# EAGLE design final (EAGLE 8.6.0)
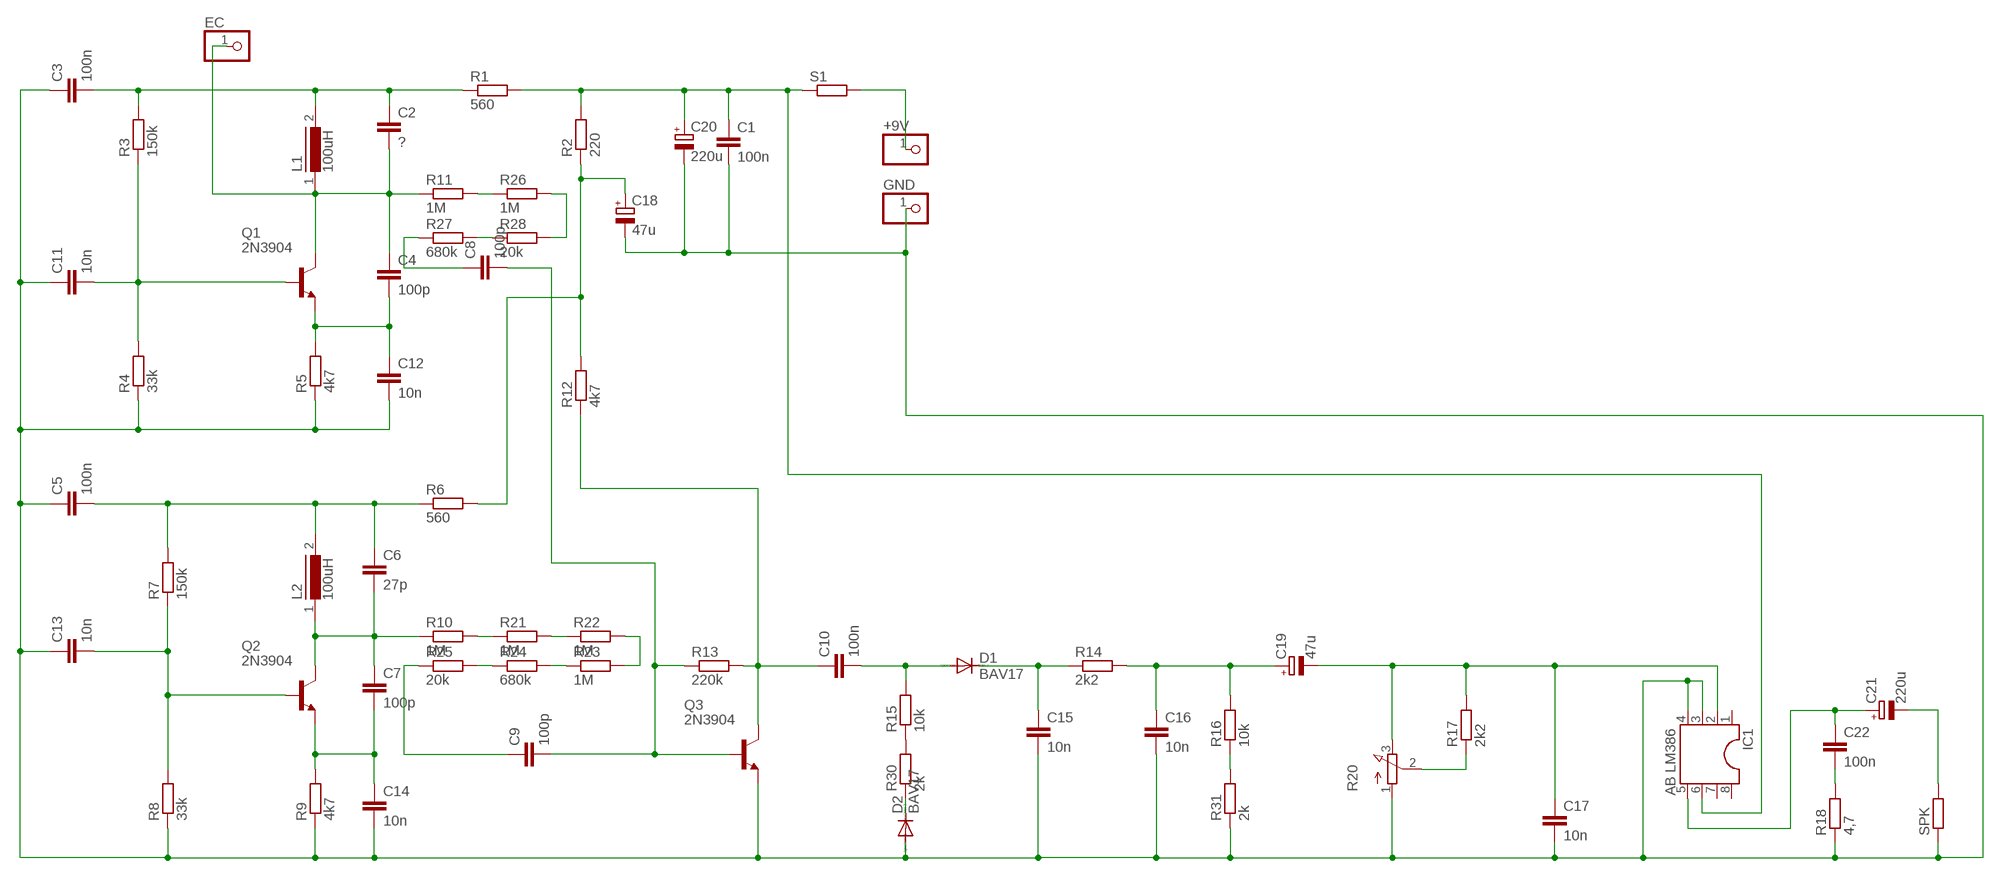
[diagram p0: schematic, sheet 1]

## Parts
+9V  PINHD-1X1  [1X01]
C1  100n  C-EU025-025X050  [C025-025X050]
C2  ?  C-EU025-025X050  [C025-025X050]
C3  100n  C-EU025-025X050  [C025-025X050]
C4  100p  C-EU025-025X050  [C025-025X050]
C5  100n  C-EU025-025X050  [C025-025X050]
C6  27p  C-EU025-025X050  [C025-025X050]
C7  100p  C-EU025-025X050  [C025-025X050]
C8  100p  C-EU025-025X050  [C025-025X050]
C9  100p  C-EU025-025X050  [C025-025X050]
C10  100n  C-EU025-025X050  [C025-025X050]
C11  10n  C-EU050-025X075  [C050-025X075]
C12  10n  C-EU050-025X075  [C050-025X075]
C13  10n  C-EU050-025X075  [C050-025X075]
C14  10n  C-EU050-025X075  [C050-025X075]
C15  10n  C-EU050-025X075  [C050-025X075]
C16  10n  C-EU050-025X075  [C050-025X075]
C17  10n  C-EU050-025X075  [C050-025X075]
C18  47u  CPOL-EUE5-6  [E5-6]
C19  47u  CPOL-EUE5-6  [E5-6]
C20  220u  CPOL-EUE5-8.5  [E5-8,5]
C21  220u  CPOL-EUE5-8.5  [E5-8,5]
C22  100n  C-EU025-025X050  [C025-025X050]
D1  BAV17  [DO35-10]
D2  BAV17  [DO35-10]
EC  PINHD-1X1  [1X01]
GND  PINHD-1X1  [1X01]
IC1  AB LM386  DIL8  [DIL08]
L1  100uH  82114R  [82114R]
L2  100uH  82114R  [82114R]
Q1  2N3904  [TO92]
Q2  2N3904  [TO92]
Q3  2N3904  [TO92]
R1  560  R-EU_0204/5  [0204/5]
R2  220  R-EU_0204/5  [0204/5]
R3  150k  R-EU_0204/5  [0204/5]
R4  33k  R-EU_0204/5  [0204/5]
R5  4k7  R-EU_0204/5  [0204/5]
R6  560  R-EU_0204/5  [0204/5]
R7  150k  R-EU_0204/5  [0204/5]
R8  33k  R-EU_0204/5  [0204/5]
R9  4k7  R-EU_0204/5  [0204/5]
R10  1M  R-EU_0204/5  [0204/5]
R11  1M  R-EU_0204/5  [0204/5]
R12  4k7  R-EU_0204/5  [0204/5]
R13  220k  R-EU_0204/5  [0204/5]
R14  2k2  R-EU_0204/5  [0204/5]
R15  10k  R-EU_0204/5  [0204/5]
R16  10k  R-EU_0204/5  [0204/5]
R17  2k2  R-EU_0204/5  [0204/5]
R18  4,7  R-EU_0204/5  [0204/5]
R20  3RP/1610N  [3RP/1610N]
R21  1M  R-EU_0204/5  [0204/5]
R22  1M  R-EU_0204/5  [0204/5]
R23  1M  R-EU_0204/5  [0204/5]
R24  680k  R-EU_0204/5  [0204/5]
R25  20k  R-EU_0204/5  [0204/5]
R26  1M  R-EU_0204/5  [0204/5]
R27  680k  R-EU_0204/5  [0204/5]
R28  20k  R-EU_0204/5  [0204/5]
R30  2k  R-EU_0204/5  [0204/5]
R31  2k  R-EU_0204/5  [0204/5]
S1  R-EU_0204/5  [0204/5]
SPK  R-EU_0204/5  [0204/5]

## Nets
N$1: C1.1 C20.+ IC1.6 R1.2 R2.2 S1.1
N$2: C21.+ C22.1 IC1.5
N$3: C13.2 Q2.2(B) R7.1 R8.2
N$4: C2.1 C3.2 L1.2 R1.1 R3.2
N$5: C2.2 C4.1 EC.1 L1.1 Q1.1(C) R11.1
N$6: C17.1 C19.- IC1.2 R17.2 R20.3(E)
N$7: C11.2 Q1.2(B) R3.1 R4.2
N$8: C4.2 C12.1 Q1.3(E) R5.2
N$9: R15.1 R30.2
N$10: R17.1 R20.2(S)
N$11: C5.2 C6.1 L2.2 R6.1 R7.2
N$12: C7.2 C14.1 Q2.3(E) R9.2
N$13: C6.2 C7.1 L2.1 Q2.1(C) R10.1
N$14: R10.2 R21.1
N$15: R21.2 R22.1
N$16: R22.2 R23.2
N$17: R23.1 R24.2
N$18: R24.1 R25.2
N$19: C9.1 R25.1
N$20: R11.2 R26.1
N$21: R26.2 R28.2
N$22: R27.2 R28.1
N$23: C8.1 R27.1
N$24: C8.2 C9.2 Q3.2(B) R13.1
N$25: C18.+ R2.1 R6.2 R12.2
N$26: C10.1 Q3.1(C) R12.1 R13.2
N$27: C10.2 D1.A R15.2
N$28: D2.C R30.1
N$29: C15.1 D1.C R14.1
N$30: C16.1 C19.+ R14.2 R16.2
N$31: C21.- SPK.2
N$32: C22.2 R18.2
N$33: R16.1 R31.2
N$34: +9V.1 S1.2
N$36: C1.2 C3.1 C5.1 C11.1 C12.2 C13.1 C14.2 C15.2 C16.2 C17.2 C18.- C20.- D2.A GND.1 IC1.3 IC1.4 Q3.3(E) R4.1 R5.1 R8.1 R9.1 R18.1 R20.1(A) R31.1 SPK.1
Unconnected: IC1.1 IC1.7 IC1.8

## Library data of the parts
+9V EC GND = pinhead:PINHD-1X1: PIN HEADER
C1-C17 C22 = rcl:C-EU: CAPACITOR, European symbol; SPICEPREFIX: C
C18-C21 = rcl:CPOL-EU: POLARIZED CAPACITOR, European symbol; SPICEPREFIX: C
D1 D2 = diode:BAV17: DIODE silicon-epitaxial planar diode
IC1 = ic-package:DIL8: Dual In Line / Socket
L1 L2 = inductors:82114R: INDUCTOR; SPICEPREFIX: L
Q1-Q3 = transistor-npn:2N3904: NPN Transistor
R1-R18 R21-R28 R30 R31 S1 SPK = rcl:R-EU_: RESISTOR, European symbol; SPICEPREFIX: R
R20 = pot:3RP/1610N: 16mm Potentiometer one level Source: http://www.alphapotentiometers.net/html/16mm_pot_2.html

## Board
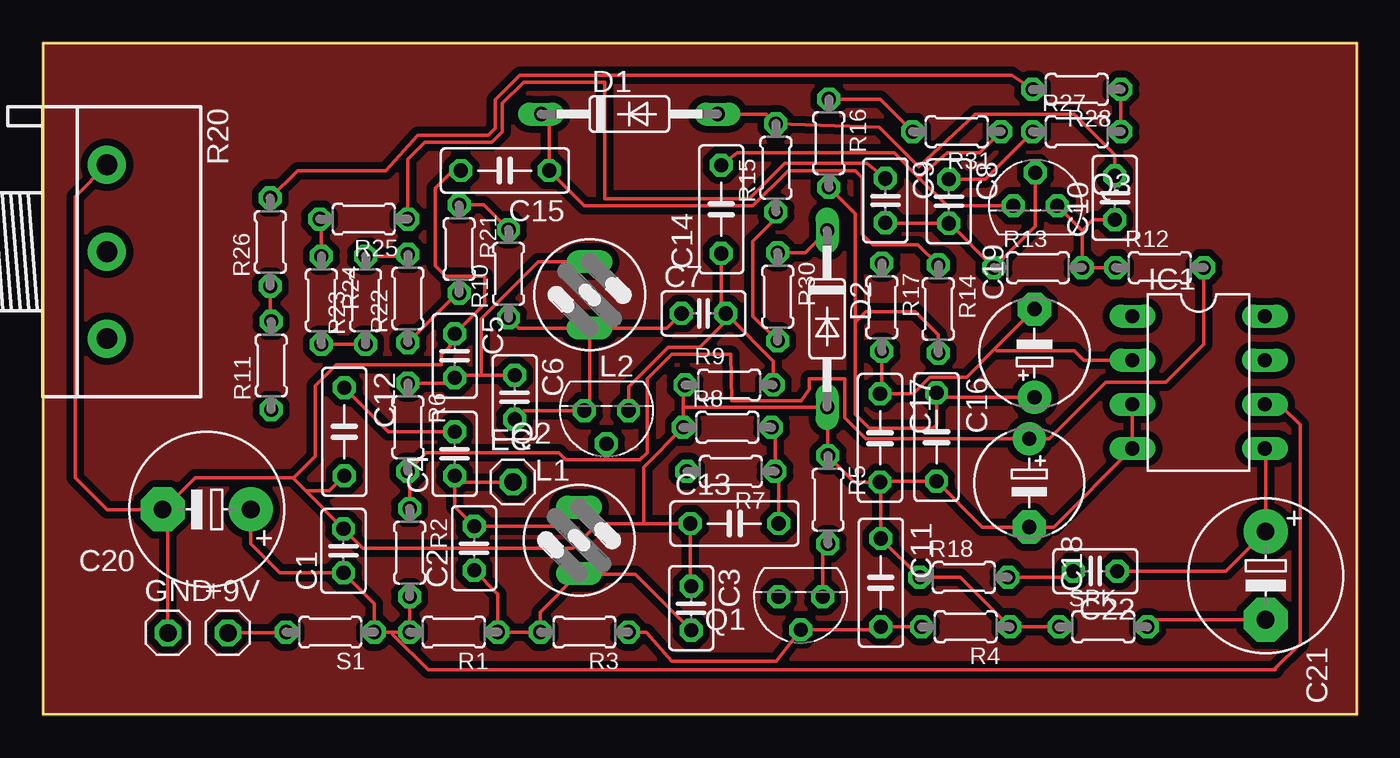
[diagram p1: board, top side]
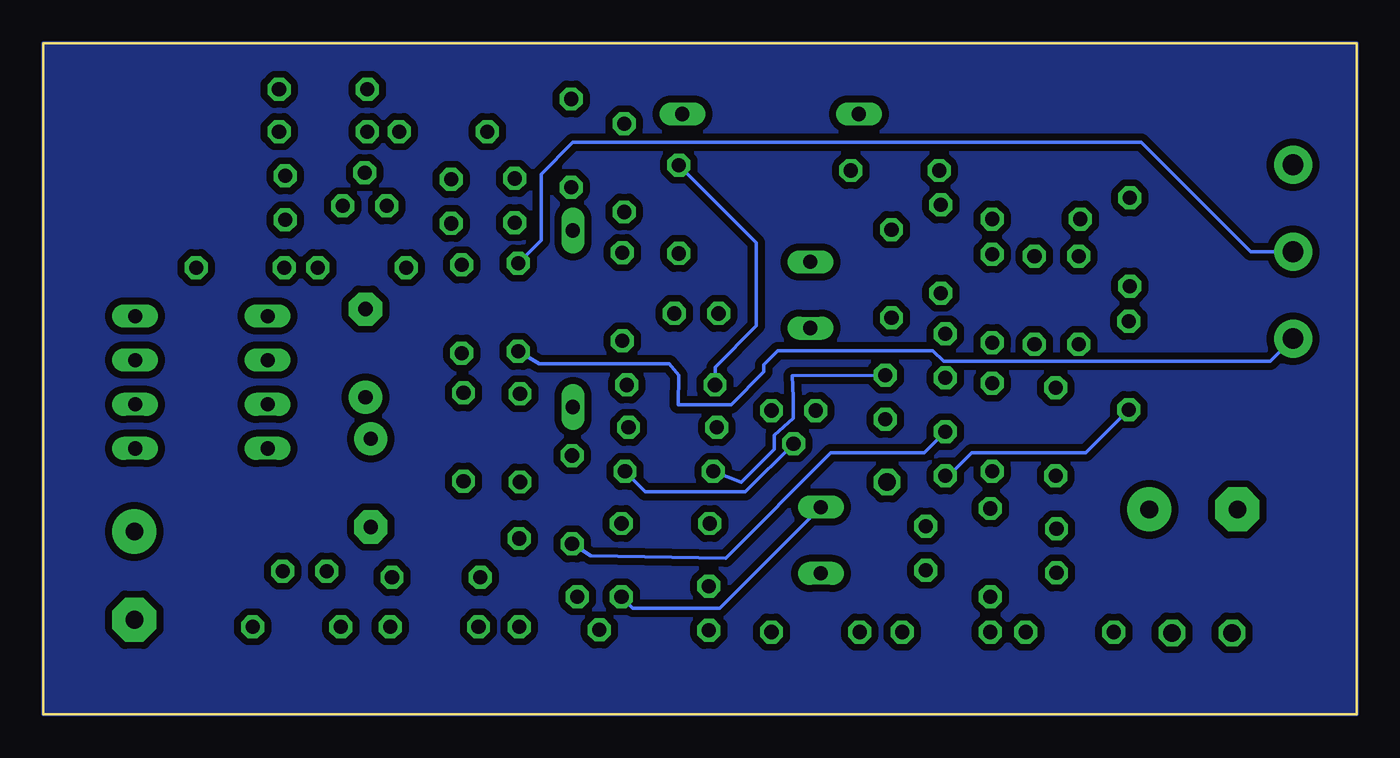
[diagram p2: board, bottom side, seen from below]

Size 75.59 x 38.61 mm. Coordinates in mm from the lower left corner, seen from the top.
Outline: 0,0 0,38.61 75.59,38.61 75.59,0 0,0
Copper layers (1*16): Top 0.035mm / dielectric 1.5mm / Bottom 0.035mm
Design rules "default *": minimum track width 6mil, minimum drill 0.35mm, track to track 6mil, track to pad 6mil, pad to pad 6mil, via to via 6mil, smd to smd 6mil, copper to edge 0mil, drill to drill 6mil, minimum pad ring 10mil, minimum via ring 8mil, stop-mask expansion 4mil, vias tented up to drill 0mil, thermal gap 10mil

### Footprints (pad centres in the part's own frame; a part is rotated, then mirrored left to right if it is on the bottom)
1X01 = drill 1.016 octagon: 1 0,0
C025-025X050 = drill 0.813 octagon: 1 -1.27,0; 2 1.27,0
C050-025X075 = drill 0.813 octagon: 1 -2.54,0; 2 2.54,0
E5-6 = drill 0.813 pad 1.905: + -2.54,0 | drill 0.813 pad 1.905 octagon: - 2.54,0
E5-8,5 = drill 1.016 pad 2.54: + -2.54,0 | drill 1.016 pad 2.54 octagon: - 2.54,0
DO35-10 = drill 0.813 long: A 5.08,0; C -5.08,0
DIL08 = drill 0.813 long: 1 -3.81,-3.81; 2 -1.27,-3.81; 3 1.27,-3.81; 4 3.81,-3.81; 5 3.81,3.81; 6 1.27,3.81; 7 -1.27,3.81; 8 -3.81,3.81
82114R = drill 0.813 long: 1 0,1.905; 2 0,-1.905
TO92 = drill 0.813 octagon: 1 1.27,0; 2 0,1.905; 3 -1.27,0
0204/5 = drill 0.813 octagon: 1 -2.54,0; 2 2.54,0
3RP/1610N = drill 1.2 pad 2.184: 1 -5,0; 2 0,0; 3 5,0

### Placement (x,y rotation side)
+9V  10.62,4.67 0 top
C1  17.27,9.4 90 top
C2  24.79,9.55 90 top
C3  37.29,6.1 270 top
C4  23.67,14.99 90 top
C5  23.67,20.62 270 top
C6  27.13,18.24 270 top
C7  38,23.06 0 top
C8  52.12,29.51 270 top
C9  48.46,29.57 270 top
C10  61.67,29.72 90 top
C11  48.21,7.57 270 top
C12  17.32,16.26 270 top
C13  39.78,10.97 0 top
C14  39.01,29.06 90 top
C15  26.57,31.29 180 top
C16  51.41,15.95 270 top
C17  48.16,15.9 270 top
C18  56.74,13.31 270 top
C19  57.05,20.78 90 top
C20  9.4,11.79 180 top
C21  70.36,7.98 270 top
C22  60.55,8.23 180 top
D1  33.73,34.54 0 top
D2  45.11,22.76 270 top
EC  27.03,13.36 0 top
GND  7.16,4.67 0 top
IC1  66.5,19.1 270 top
L1  30.84,10.01 0 top
L2  31.45,24.13 180 top
Q1  43.59,6.76 180 top
Q2  32.41,17.48 180 top
Q3  57.1,29.26 0 top
R1  23.62,4.72 180 top
R2  21.08,9.3 270 top
R3  31.14,4.72 180 top
R4  53.09,5.03 180 top
R5  45.16,12.34 270 top
R6  20.98,16.51 270 top
R7  39.57,13.97 180 top
R8  39.37,16.51 0 top
R9  39.47,18.95 0 top
R10  26.77,25.35 90 top
R11  13.11,20.07 90 top
R12  64.26,25.7 0 top
R13  57.25,25.7 0 top
R14  51.51,23.32 270 top
R15  42.16,31.45 90 top
R16  45.21,32.87 270 top
R17  48.26,23.42 270 top
R18  52.98,7.87 0 top
R20  3.66,26.62 270 top
R21  23.93,26.77 270 top
R22  20.98,23.93 90 top
R23  18.54,23.83 90 top
R24  16,23.83 270 top
R25  18.44,28.5 180 top
R26  13.06,27.18 90 top
R27  59.49,33.53 0 top
R28  59.49,35.97 180 top
R30  42.27,24.03 270 top
R31  52.58,33.53 180 top
S1  16.51,4.72 180 top
SPK  61.01,5.03 0 top

### Tracks (layer width: path | path; a pad name or v marks a point on that pad's centre or on a via)
GND
  pour Bottom (isolate 0.406): 0,38.61 75.59,38.61 75.59,0 0,0
  pour Top (isolate 0.406): 0,38.61 75.59,38.61 75.59,0 0,0
N$1
  Top 0.203: 20.12,4.72 S1.1 19.05,6.35 C1.1 13.61,8.13 11.94,9.8 C20.+ | 20.12,4.72 R1.2 R2.2 | IC1.6 70.46,17.68 71.32,17.68 72.34,16.66 72.34,4.06 70.92,2.64 70.92,2.54 22.15,2.54 20.12,4.57 20.12,4.72
N$2
  Top 0.203: C22.1 68.07,8.23 C21.+ 70.36,15.24 IC1.5
N$3
  Top 0.203: C13.2 42.32,13.77 R7.1 42.11,16.31 R8.2
  Bottom 0.203: Q2.2 35.18,12.8 40.95,12.8 R7.1
N$4
  Top 0.203: C2.1 26.16,6.91 R1.1 R3.2 28.6,5.87 30.77,8.04 | 30.77,8.04 L1.2 | C3.2 34.07,8.04 30.77,8.04
N$5
  Top 0.203: L1.1 29.74,10.82 C2.2 23.67,11.94 C4.1 24.03,13.36 EC.1
  Bottom 0.203: L1.1 36.65,6.1 41.66,6.1 Q1.1 | R11.1 15.6,15.04 22.15,15.04 23.47,13.72 C4.1
N$6
  Top 0.203: 54.76,21.03 C19.- 57.15,23.42 | 54.76,21.03 53.14,19.41 51.03,19.41 50.07,18.44 C17.1 48.26,18.54 R17.2 | IC1.2 59.89,20.37 59.33,20.93 54.86,20.93 54.76,21.03
  Bottom 0.203: R17.2 47.04,20.17 39.57,20.17 39.01,19.51 39.04,17.81 35.99,17.81 34.14,19.71 34.14,20.12 33.33,20.93 24.38,20.93 23.77,20.32 4.96,20.32 R20.3
N$7
  Top 0.203: R3.1 34.7,4.72 36.17,3.05 42.19,3.05 Q1.2 48.03,4.85 C11.2 R4.2
N$8
  Top 0.203: Q1.3 44.86,9.5 R5.2 | C4.2 19.86,16.26 C12.1
  Bottom 0.203: R5.2 44.09,9.12 36.32,8.97 30.28,15.04 24.89,15.04 C4.2
N$9
  Top 0.203: R15.1 42.16,28.55 40.84,27.23 40.84,22.91 R30.2
N$10
  Bottom 0.203: R20.2 6.1,26.62 12.39,32.92 45.11,32.92 46.94,31.09 46.94,27.28 R17.1
N$11
  Top 0.203: C6.1 25.2,19.51 | 25.2,19.51 23.82,19.51 C5.2 23.37,19.05 R6.1 | 25.2,19.51 25.2,22.76 28.47,26.04 L2.2
  Bottom 0.203: R7.2 35.41,13.36 33.53,15.24 33.53,16.05 32.44,17.02 32.44,18.24 32.49,19.48 C6.1
N$12
  Top 0.203: C14.1 39.01,23.32 C7.2 39.5,22.83 | R9.2 42.01,20.32 39.5,22.83 | Q2.3 33.68,18.85 35.97,21.13 37.8,21.13 39.5,22.83
N$13
  Top 0.203: C6.2 27.64,17.48 Q2.1 31.45,17.78 L2.1 | C7.1 35.89,22.23 L2.1 | L2.1 27.36,22.23 R10.1
N$14
  Top 0.203: R10.2 25.35,29.31 R21.1
N$15
  Top 0.203: R22.1 23.82,24.23 R21.2
N$16
  Top 0.203: R23.2 20.88,26.37 R22.2
N$17
  Top 0.203: R23.1 R24.2
N$18
  Top 0.203: R24.1 16,28.4 R25.2
N$19
  Top 0.203: C9.1 47.4,31.7 42.67,31.7 40.64,29.67 32.31,29.67 32.31,36.37 27.64,36.37 26.42,35.15 26.42,33.53 25.81,32.92 21.95,32.92 20.98,31.95 R25.1
N$20
  Top 0.203: R26.1 13.06,22.66 R11.2
N$21
  Top 0.203: R28.2 55.73,36.78 27.43,36.78 26.01,35.36 26.01,33.73 25.6,33.32 21.54,33.32 19.71,31.29 14.63,31.29 R26.2
N$22
  Top 0.203: R27.2 R28.1
N$23
  Top 0.203: C8.1 54.2,30.78 R27.1
N$24
  Top 0.203: Q3.2 57.1,28.09 R13.1 52.17,28.24 C8.2 48.51,28.24 C9.2
N$25
  Top 0.203: R2.1 21.08,13.87 R6.2 22.05,15.04 29.67,15.04 30.07,14.63 34.34,14.63 34.75,15.04 34.75,19.3 36.17,20.73 39.57,20.73 39.62,18.03 43.64,18.03 44.09,18.69 44.09,19.3 46.13,19.3 46.13,17.07 47.35,15.85 C18.+ 57.91,15.85 61.16,19.1 64.62,19.1 66.8,21.29 R12.2
N$26
  Top 0.203: Q3.1 59.79,27.84 | 59.79,27.84 R13.2 R12.1 | 59.79,27.84 60.4,28.45 C10.1
N$27
  Top 0.203: D1.A 41.6,34.54 R15.2 48.11,33.78 50.39,31.5 53.65,34.54 59.33,34.54 61.67,32.21 C10.2
N$28
  Top 0.203: R30.1 43.84,26.57 D2.C
N$29
  Top 0.203: D1.C 29.11,34.09 C15.1 31.14,29.26 40.84,29.26 42.88,31.29 46.74,31.29 47.14,30.89 47.14,27.64 47.75,27.03 50.34,27.03 R14.1
N$30
  Top 0.203: C19.+ 51.66,18.24 C16.1 51.41,16.66 51.21,16.46 47.55,16.46 46.74,17.27 46.74,22.56 | 46.74,22.56 47.35,23.16 50.19,23.16 51.51,21.84 R14.2 | R16.2 46.74,28.8 46.74,22.56
N$31
  Top 0.203: SPK.2 63.96,5.44 C21.-
N$32
  Top 0.203: R18.2 58.93,7.87 C22.2
N$33
  Top 0.203: R31.2 48.16,35.41 R16.1
N$34
  Top 0.203: +9V.1 13.92,4.67 S1.2
N$36
  Top 0.203: GND.1 7.16,11.48 6.88,11.76 | 6.88,11.76 C20.- | 15.09,12.85 C1.2 18.39,9.55 30.48,9.55 31.9,10.97 34.54,10.97 | 15.09,12.85 14.38,13.56 | 14.38,13.56 14.33,13.61 8.74,13.61 6.88,11.76 | C12.2 16.46,12.85 15.09,12.85 | C3.1 37.24,7.42 C13.1 34.54,10.97 | SPK.1 R4.1 52.78,7.87 R18.1 C11.1 48.21,13.31 C17.2 | C17.2 48.21,13.41 C16.2 54.05,10.77 C18.- 58.17,10.77 IC1.4 IC1.3 | C17.2 46.69,13.36 R5.1 45.16,17.63 D2.A 36.83,17.68 | 34.54,10.97 34.54,14.22 R8.1 36.83,17.68 | R20.1 1.83,29.79 1.83,13.61 3.68,11.76 6.88,11.76 | 36.83,17.68 36.83,18.85 R9.1 | R31.1 53.9,32.31 52.02,32.31 50.39,30.89 | 50.39,30.89 52.02,29.26 Q3.3 | 50.39,30.89 48.97,32.31 39.93,32.31 C14.2 | C15.2 23.57,31.29 22.55,30.28 22.55,25.81 23.16,25.2 25.4,25.2 25.4,23.62 C5.1 23.37,21.13 22.91,20.68 22.91,20.12 16.87,20.12 15.65,18.9 15.65,14.83 14.38,13.56
  Bottom 0.203: R9.1 36.93,19.96 34.54,22.35 34.54,27.13 C14.2